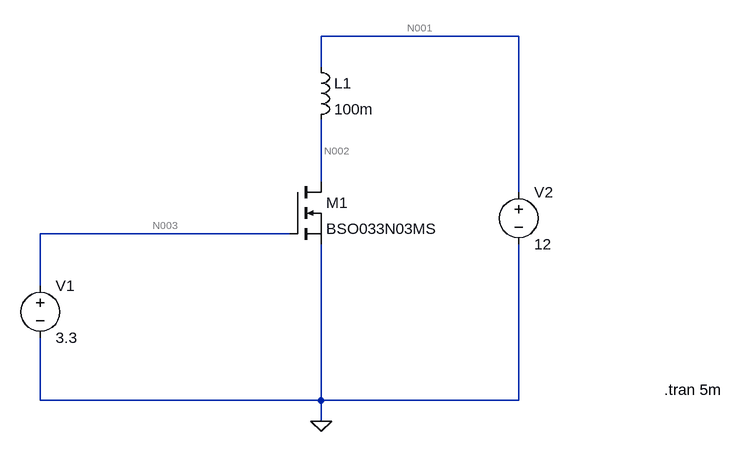
[diagram p0: schematic elektrozaczep.asc]
elektrozaczep.asc, the LTspice schematic file:
Version 4.1
SHEET 1 880 680
WIRE 528 -352 224 -352
WIRE 224 -304 224 -352
WIRE 224 -128 224 -224
WIRE 528 -112 528 -352
WIRE 176 -48 -208 -48
WIRE -208 32 -208 -48
WIRE -208 208 -208 112
WIRE 224 208 224 -32
WIRE 224 208 -208 208
WIRE 528 208 528 -32
WIRE 528 208 224 208
WIRE 224 240 224 208
FLAG 224 240 0
SYMBOL voltage -208 16 R0
WINDOW 123 0 0 Left 0
WINDOW 39 0 0 Left 0
SYMATTR InstName V1
SYMATTR Value 3.3
SYMBOL nmos 176 -128 R0
SYMATTR InstName M1
SYMATTR Value BSO033N03MS
SYMBOL ind 208 -320 R0
SYMATTR InstName L1
SYMATTR Value 100m
SYMATTR SpiceLine Rser=20
SYMBOL voltage 528 -128 R0
WINDOW 123 0 0 Left 0
WINDOW 39 0 0 Left 0
SYMATTR InstName V2
SYMATTR Value 12
TEXT 752 192 Left 2 !.tran 5m

The netlist it stands for:
* elektrozaczep.asc
V1 N003 0 3.3
M1 N002 N003 0 0 BSO033N03MS
L1 N001 N002 100m Rser=20
V2 N001 0 12
.model NMOS NMOS
.model PMOS PMOS
.lib standard.mos
.tran 5m
.backanno
.end

* Results of the author's LTspice run, read from the files saved beside the schematic
* Operating Point, zero values left out:
*   V(n002) = 2.676 mV
*   V(n003) = 3.3 V
*   V(n001) = 12 V
*   I(L1) = 599.9 mA
*   Id(M1) = 599.9 mA
*   Is(M1) = -599.9 mA
*   I(V2) = -599.9 mA